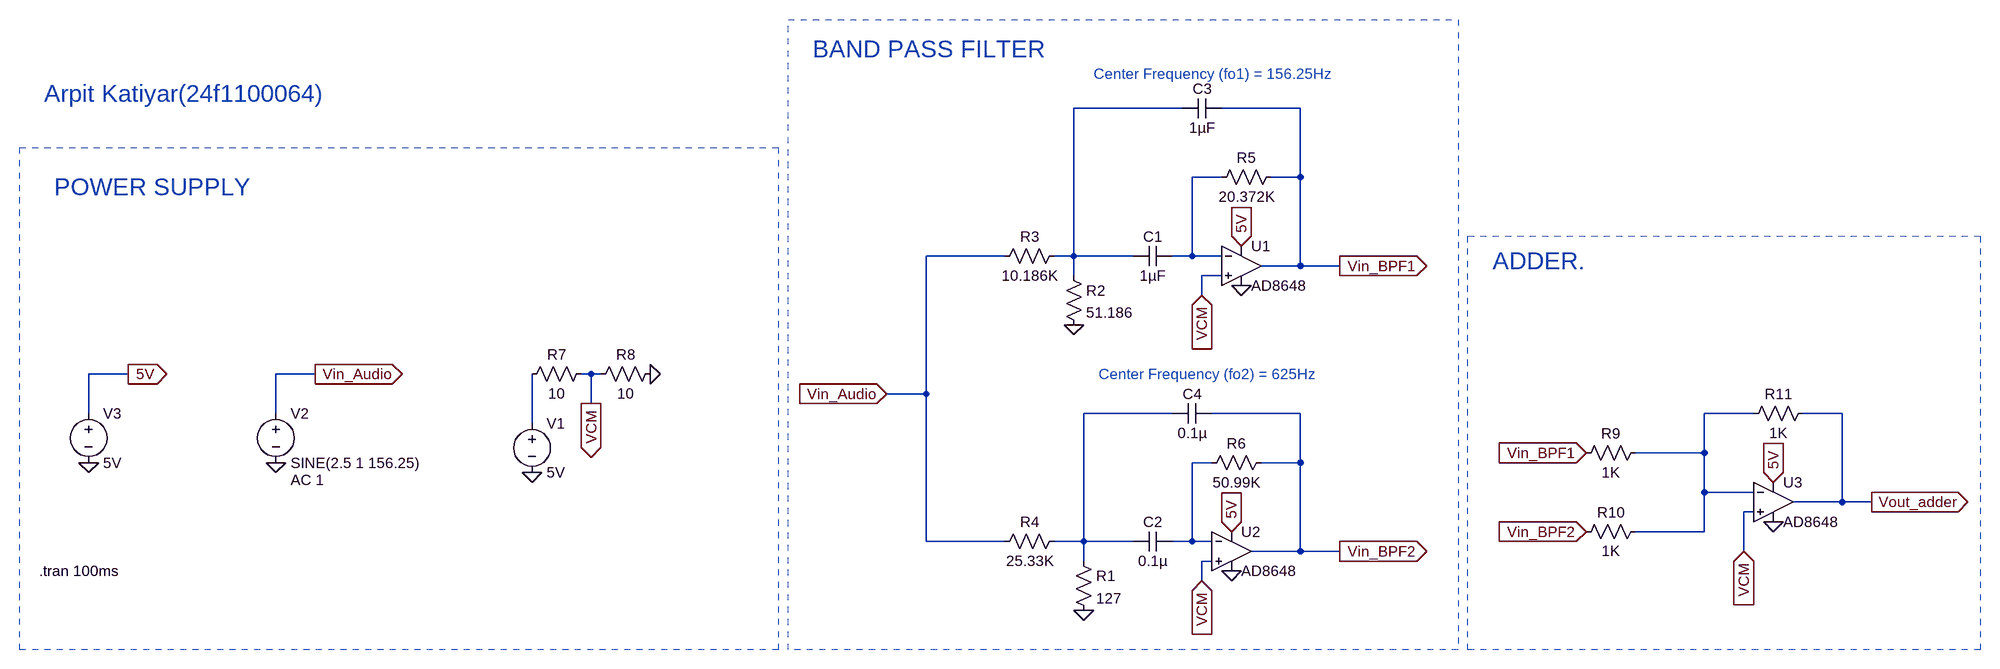
[diagram p0: schematic Analog5.asc]
Analog5.asc, the LTspice schematic file:
Version 4
SHEET 1 2596 836
WIRE 1264 -48 1088 -48
WIRE 1456 -48 1328 -48
WIRE 1328 64 1280 64
WIRE 1456 64 1456 -48
WIRE 1456 64 1408 64
WIRE 976 192 848 192
WIRE 1088 192 1088 -48
WIRE 1088 192 1056 192
WIRE 1184 192 1088 192
WIRE 1280 192 1280 64
WIRE 1280 192 1248 192
WIRE 1328 192 1280 192
WIRE 1456 208 1456 64
WIRE 1456 208 1392 208
WIRE 1520 208 1456 208
WIRE 1088 224 1088 192
WIRE 1328 224 1296 224
WIRE 1296 256 1296 224
WIRE -448 384 -512 384
WIRE -144 384 -208 384
WIRE 304 384 288 384
WIRE 320 384 304 384
WIRE 848 416 848 192
WIRE 848 416 784 416
WIRE 304 432 304 384
WIRE -512 448 -512 384
WIRE -208 448 -208 384
WIRE 1248 448 1104 448
WIRE 1456 448 1312 448
WIRE 2192 448 2112 448
WIRE 2336 448 2272 448
WIRE 208 464 208 384
WIRE 2112 512 2112 448
WIRE 2112 512 2000 512
WIRE 1312 528 1280 528
WIRE 1456 528 1456 448
WIRE 1456 528 1392 528
WIRE 2112 576 2112 512
WIRE 2192 576 2112 576
WIRE 2336 592 2336 448
WIRE 2336 592 2256 592
WIRE 2384 592 2336 592
WIRE 2192 608 2176 608
WIRE 2112 640 2112 576
WIRE 2112 640 2000 640
WIRE 848 656 848 416
WIRE 976 656 848 656
WIRE 1104 656 1104 448
WIRE 1104 656 1056 656
WIRE 1184 656 1104 656
WIRE 1280 656 1280 528
WIRE 1280 656 1248 656
WIRE 1312 656 1280 656
WIRE 1456 672 1456 528
WIRE 1456 672 1376 672
WIRE 1520 672 1456 672
WIRE 2176 672 2176 608
WIRE 1104 688 1104 656
WIRE 1312 688 1296 688
WIRE 1296 720 1296 688
FLAG 1360 240 0
FLAG 1088 304 0
FLAG 1104 768 0
FLAG 1344 704 0
FLAG 208 544 0
FLAG -208 528 0
FLAG -512 528 0
FLAG 400 384 0
FLAG 784 416 Vin_Audio
IOPIN 784 416 In
FLAG -144 384 Vin_Audio
IOPIN -144 384 Out
FLAG 1520 208 Vin_BPF1
IOPIN 1520 208 Out
FLAG 1520 672 Vin_BPF2
IOPIN 1520 672 Out
FLAG -448 384 5V
IOPIN -448 384 Out
FLAG 1360 176 5V
IOPIN 1360 176 In
FLAG 1344 640 5V
IOPIN 1344 640 In
FLAG 304 432 VCM
IOPIN 304 432 Out
FLAG 1296 720 VCM
IOPIN 1296 720 In
FLAG 1296 256 VCM
IOPIN 1296 256 In
FLAG 2224 624 0
FLAG 2224 560 5V
IOPIN 2224 560 In
FLAG 2176 672 VCM
IOPIN 2176 672 In
FLAG 1920 512 Vin_BPF1
IOPIN 1920 512 In
FLAG 1920 640 Vin_BPF2
IOPIN 1920 640 In
FLAG 2384 592 Vout_adder
IOPIN 2384 592 Out
SYMBOL OpAmps\\AD8648 1360 144 R0
SYMATTR InstName U1
SYMBOL OpAmps\\AD8648 1344 608 R0
SYMATTR InstName U2
SYMBOL cap 1248 176 R90
WINDOW 0 0 32 VBottom 2
WINDOW 3 32 32 VTop 2
SYMATTR InstName C1
SYMATTR Value 1µF
SYMBOL cap 1248 640 R90
WINDOW 0 0 32 VBottom 2
WINDOW 3 32 32 VTop 2
SYMATTR InstName C2
SYMATTR Value 0.1µ
SYMBOL cap 1328 -64 R90
WINDOW 0 0 32 VBottom 2
WINDOW 3 32 32 VTop 2
SYMATTR InstName C3
SYMATTR Value 1µF
SYMBOL cap 1312 432 R90
WINDOW 0 0 32 VBottom 2
WINDOW 3 32 32 VTop 2
SYMATTR InstName C4
SYMATTR Value 0.1µ
SYMBOL res 1088 672 R0
SYMATTR InstName R1
SYMATTR Value 127
SYMBOL res 1072 208 R0
SYMATTR InstName R2
SYMATTR Value 51.186
SYMBOL res 1072 176 R90
WINDOW 0 0 56 VBottom 2
WINDOW 3 32 56 VTop 2
SYMATTR InstName R3
SYMATTR Value 10.186K
SYMBOL res 1072 640 R90
WINDOW 0 0 56 VBottom 2
WINDOW 3 32 56 VTop 2
SYMATTR InstName R4
SYMATTR Value 25.33K
SYMBOL res 1424 48 R90
WINDOW 0 0 56 VBottom 2
WINDOW 3 32 56 VTop 2
SYMATTR InstName R5
SYMATTR Value 20.372K
SYMBOL res 1408 512 R90
WINDOW 0 0 56 VBottom 2
WINDOW 3 32 56 VTop 2
SYMATTR InstName R6
SYMATTR Value 50.99K
SYMBOL voltage 208 448 R0
WINDOW 123 0 0 Left 0
WINDOW 39 0 0 Left 0
SYMATTR InstName V1
SYMATTR Value 5V
SYMBOL voltage -208 432 R0
WINDOW 123 24 124 Left 2
WINDOW 39 0 0 Left 0
SYMATTR Value2 AC 1
SYMATTR InstName V2
SYMATTR Value SINE(2.5 1 156.25)
SYMBOL voltage -512 432 R0
WINDOW 123 0 0 Left 0
WINDOW 39 0 0 Left 0
SYMATTR InstName V3
SYMATTR Value 5V
SYMBOL res 304 368 R90
WINDOW 0 0 56 VBottom 2
WINDOW 3 32 56 VTop 2
SYMATTR InstName R7
SYMATTR Value 10
SYMBOL res 416 368 R90
WINDOW 0 0 56 VBottom 2
WINDOW 3 32 56 VTop 2
SYMATTR InstName R8
SYMATTR Value 10
SYMBOL OpAmps\\AD8648 2224 528 R0
SYMATTR InstName U3
SYMBOL res 2016 496 R90
WINDOW 0 0 56 VBottom 2
WINDOW 3 32 56 VTop 2
SYMATTR InstName R9
SYMATTR Value 1K
SYMBOL res 2016 624 R90
WINDOW 0 0 56 VBottom 2
WINDOW 3 32 56 VTop 2
SYMATTR InstName R10
SYMATTR Value 1K
SYMBOL res 2288 432 R90
WINDOW 0 0 56 VBottom 2
WINDOW 3 32 56 VTop 2
SYMATTR InstName R11
SYMATTR Value 1K
TEXT -592 704 Left 2 !.tran 100ms
TEXT -568 80 Left 4 ;POWER SUPPLY
TEXT 664 -144 Left 4 ;BAND PASS FILTER
TEXT 1120 -104 Left 2 ;Center Frequency (fo1) = 156.25Hz
TEXT 1128 384 Left 2 ;Center Frequency (fo2) = 625Hz
TEXT 1768 200 Left 4 ;ADDER.
TEXT -584 -72 Left 4 ;Arpit Katiyar(24f1100064)
RECTANGLE Normal 608 832 -624 16 2
RECTANGLE Normal 2560 832 1728 160 2
RECTANGLE Normal 1712 832 624 -192 2

The netlist it stands for:
* Analog5.asc
XU1 VCM N002 5V 0 Vin_BPF1 AD8648  ; pins In+ In- V+ V- OUT
XU2 VCM N006 5V 0 Vin_BPF2 AD8648  ; pins In+ In- V+ V- OUT
C1 N002 N001 1µF
C2 N006 N003 0.1µ
C3 Vin_BPF1 N001 1µF
C4 Vin_BPF2 N003 0.1µ
R1 N003 0 127
R2 N001 0 51.186
R3 N001 Vin_Audio 10.186K
R4 N003 Vin_Audio 25.33K
R5 Vin_BPF1 N002 20.372K
R6 Vin_BPF2 N006 50.99K
V1 N005 0 5V
V2 Vin_Audio 0 SINE(2.5 1 156.25) AC 1
V3 5V 0 5V
R7 VCM N005 10
R8 0 VCM 10
XU3 VCM N004 5V 0 Vout_adder AD8648  ; pins In+ In- V+ V- OUT
R9 N004 Vin_BPF1 1K
R10 N004 Vin_BPF2 1K
R11 Vout_adder N004 1K
.tran 100ms
* POWER SUPPLY
* BAND PASS FILTER
* Center Frequency (fo1) = 156.25Hz
* Center Frequency (fo2) = 625Hz
* ADDER.
* Arpit Katiyar(24f1100064)
.lib ADI.lib
.backanno
.end